# EAGLE design Complete-Power-Supply (EAGLE 9.0.0)
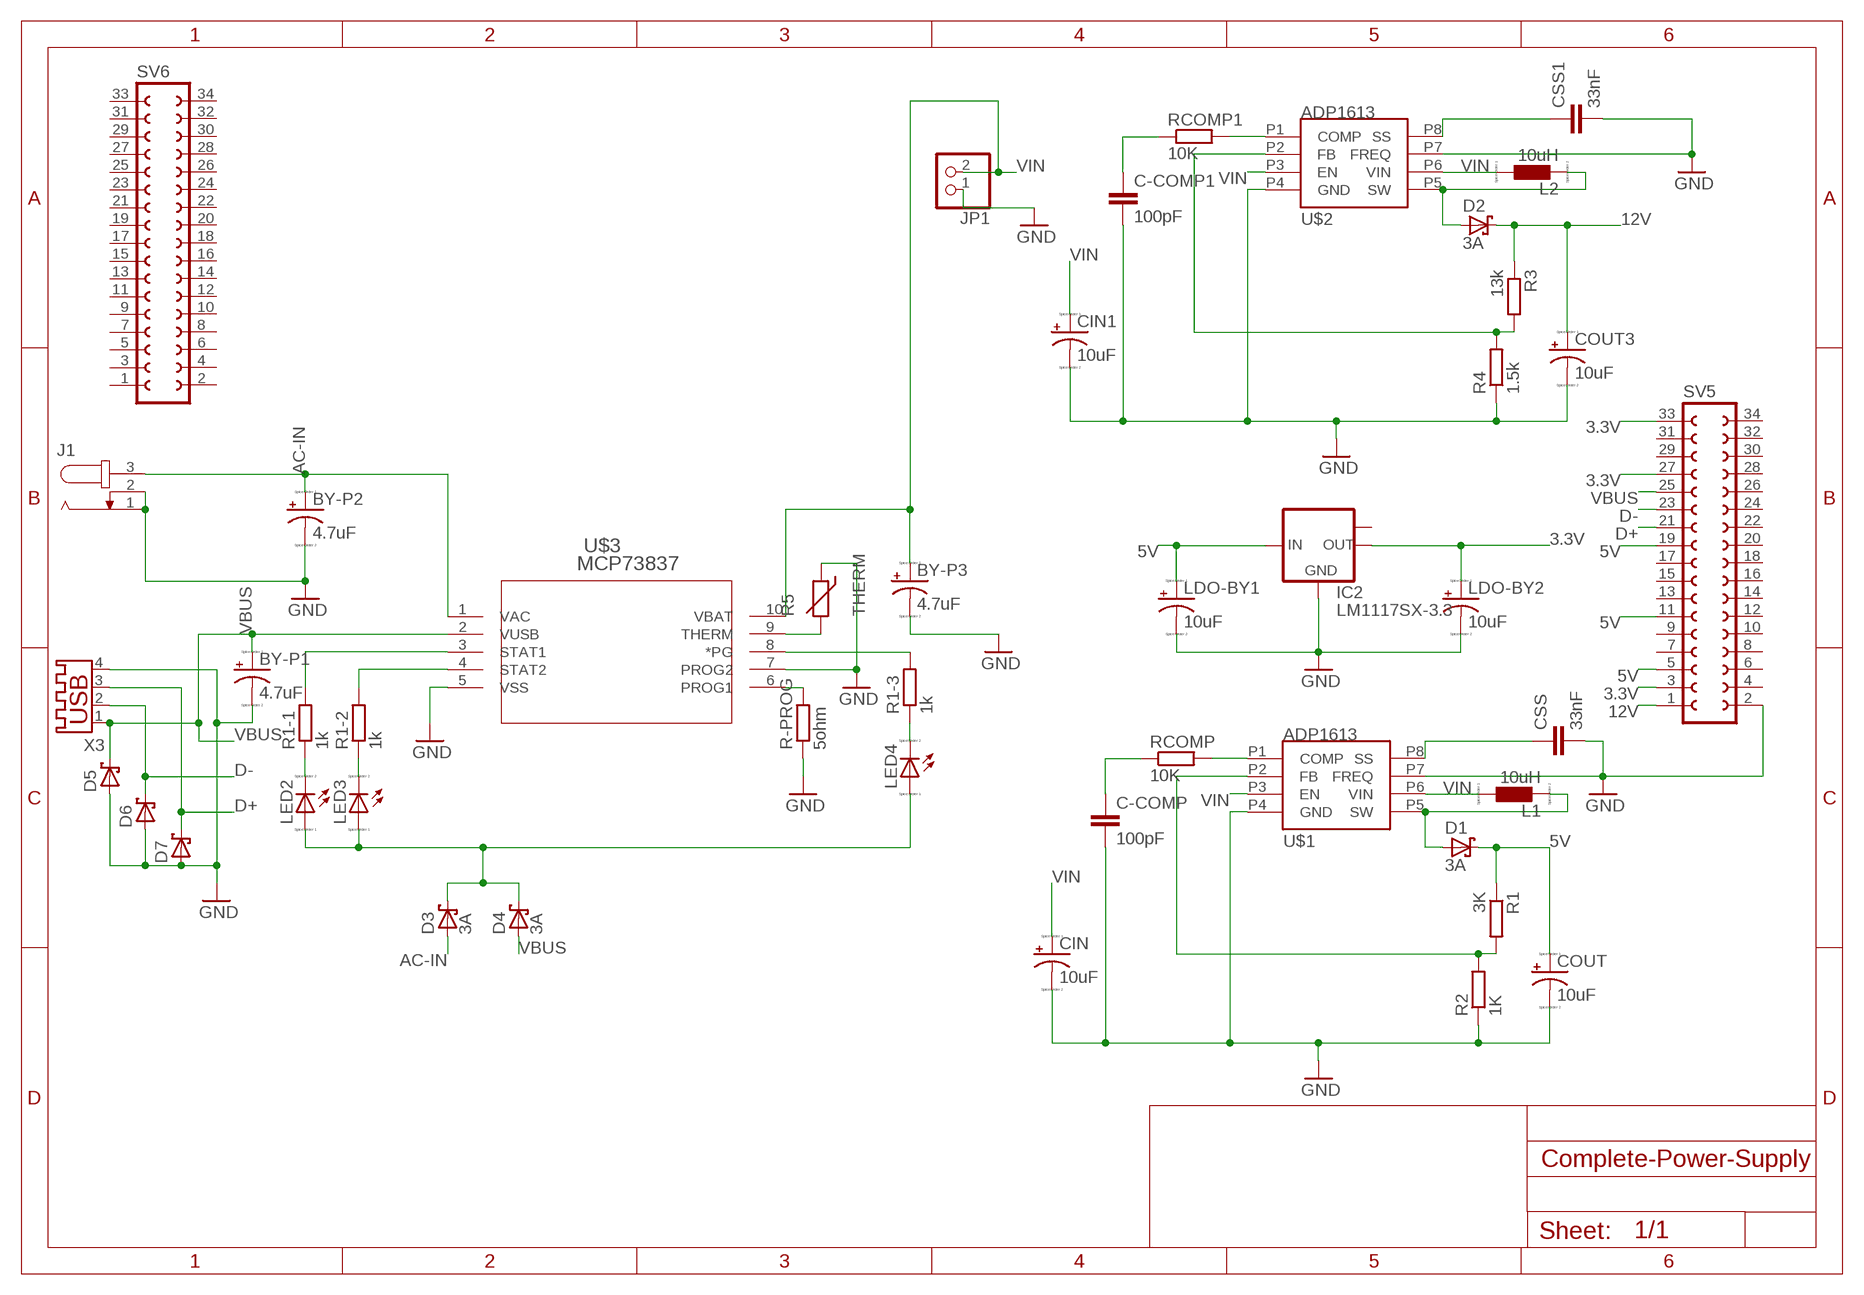
[diagram p0: schematic, sheet 1]

## Parts
BY-P1  4.7uF  CPOL-USCT3528  [CT3528]
BY-P2  4.7uF  CPOL-USCT3528  [CT3528]
BY-P3  4.7uF  CPOL-USCT3528  [CT3528]
C-COMP  100pF  C-EUC1206K  [C1206K]
C-COMP1  100pF  C-EUC1206K  [C1206K]
CIN  10uF  CPOL-USCT3528  [CT3528]
CIN1  10uF  CPOL-USCT3528  [CT3528]
COUT  10uF  CPOL-USCT3528  [CT3528]
COUT3  10uF  CPOL-USCT3528  [CT3528]
CSS  33nF  C-EUC1206K  [C1206K]
CSS1  33nF  C-EUC1206K  [C1206K]
D1  3A  SCHOTTKY-DIODESMD  [SMB]
D2  3A  SCHOTTKY-DIODESMD  [SMB]
D3  3A  SCHOTTKY-DIODESMD  [SMB]
D4  3A  SCHOTTKY-DIODESMD  [SMB]
D5  SCHOTTKY-DIODESMD  [SMB]
D6  SCHOTTKY-DIODESMD  [SMB]
D7  SCHOTTKY-DIODESMD  [SMB]
IC2  LM1117SX-3.3  [TO263]
J1  JACK-PLUG1  [SPC4078]
JP1  PINHD-1X2/90  [1X02/90]
L1  10uH  L0207/10  [0207/10]
L2  10uH  L0207/10  [0207/10]
LDO-BY1  10uF  CPOL-USCT3528  [CT3528]
LDO-BY2  10uF  CPOL-USCT3528  [CT3528]
LED2  LED_ESML0603  [LED_SML0603]
LED3  LED_ESML0603  [LED_SML0603]
LED4  LED_ESML0603  [LED_SML0603]
R1  3K  R-EU_M0805  [M0805]
R1-1  1k  R-EU_M0805  [M0805]
R1-2  1k  R-EU_M0805  [M0805]
R1-3  1k  R-EU_M0805  [M0805]
R2  1K  R-EU_M0805  [M0805]
R3  13k  R-EU_M0805  [M0805]
R4  1.5k  R-EU_M0805  [M0805]
R5  THERM  THERMISTOR-5  [R-5]
R-PROG  5ohm  R-EU_M0805  [M0805]
RCOMP  10K  R-EU_M0805  [M0805]
RCOMP1  10K  R-EU_M0805  [M0805]
SV5  FE17-2W  [FE17-2W]
SV6  FE17-2W  [FE17-2W]
U$1  ADP1613  [RM-8]
U$2  ADP1613  [RM-8]
U$3  MCP73837  MCP73837-FCI/UN  [SOP50P490X110-8N]
X3  USB-A003  [USB-A003]

## Nets
3.3V: IC2.2(OUT) LDO-BY2.-(+) SV5.3 SV5.27 SV5.33
5V: COUT.-(+) D1.C IC2.3(IN) LDO-BY1.-(+) R1.1 SV5.5 SV5.11 SV5.19
12V: COUT3.-(+) D2.C R3.1 SV5.1
AC-IN: BY-P2.-(+) D3.A J1.3 U$3.1(VAC)
D+: D7.C SV5.21 X3.3
D-: D6.C SV5.23 X3.2
GND: BY-P1.+(-) BY-P2.+(-) BY-P3.+(-) C-COMP1.2 C-COMP.2 CIN1.+(-) CIN.+(-) COUT3.+(-) COUT.+(-) CSS1.2 CSS.2 D5.A D6.A D7.A IC2.1(GND) J1.1 J1.2 JP1.1 LDO-BY1.+(-) LDO-BY2.+(-) R2.1 R4.1 R5.1 R-PROG.1 SV5.2 U$1.P4(GND) U$1.P7(FREQ) U$2.P4(GND) U$2.P7(FREQ) U$3.5(VSS) U$3.7(PROG2) X3.4
N$1: CSS.1 U$1.P8(SS)
N$2: D1.A L1.2 U$1.P5(SW)
N$3: RCOMP.2 U$1.P1(COMP)
N$4: C-COMP.1 RCOMP.1
N$5: D2.A L2.2 U$2.P5(SW)
N$6: R1.2 R2.2 U$1.P2(FB)
N$7: CSS1.1 U$2.P8(SS)
N$8: RCOMP1.2 U$2.P1(COMP)
N$9: R3.2 R4.2 U$2.P2(FB)
N$11: C-COMP1.1 RCOMP1.1
N$12: R-PROG.2 U$3.6(PROG1)
N$13: R5.2 U$3.9(THERM)
N$15: LED2.C R1-1.1
N$16: R1-1.2 U$3.3(STAT1)
N$17: R1-2.2 U$3.4(STAT2)
N$18: R1-3.2 U$3.8(*PG)
N$19: LED3.C R1-2.1
N$20: LED4.C R1-3.1
N$23: D3.C D4.C LED2.A LED3.A LED4.A
VBUS: BY-P1.-(+) D4.A D5.C SV5.25 U$3.2(VUSB) X3.1
VIN: BY-P3.-(+) CIN1.-(+) CIN.-(+) JP1.2 L1.1 L2.1 U$1.P3(EN) U$1.P6(VIN) U$2.P3(EN) U$2.P6(VIN) U$3.10(VBAT)
Unconnected: IC2.TAB(OUT1) SV5.4 SV5.6 SV5.7 SV5.8 SV5.9 SV5.10 SV5.12 SV5.13 SV5.14 SV5.15 SV5.16 SV5.17 SV5.18 SV5.20 SV5.22 SV5.24 SV5.26 SV5.28 SV5.29 SV5.30 SV5.31 SV5.32 SV5.34 SV6.1 SV6.2 SV6.3 SV6.4 SV6.5 SV6.6 SV6.7 SV6.8 SV6.9 SV6.10 SV6.11 SV6.12 SV6.13 SV6.14 SV6.15 SV6.16 SV6.17 SV6.18 SV6.19 SV6.20 SV6.21 SV6.22 SV6.23 SV6.24 SV6.25 SV6.26 SV6.27 SV6.28 SV6.29 SV6.30 SV6.31 SV6.32 SV6.33 SV6.34

## Library data of the parts
BY-P1-BY-P3 CIN CIN1 COUT COUT3 LDO-BY1 LDO-BY2 = resistor:CPOL-US: POLARIZED CAPACITOR, American symbol
C-COMP C-COMP1 CSS CSS1 = rcl:C-EU: CAPACITOR, European symbol; SPICEPREFIX: C
D1-D7 = diode:SCHOTTKY-DIODE: Schottky Diode
IC2 = lm1117:LM1117SX-*
J1 = con-jack:JACK-PLUG: DC POWER JACK Power Jack, DC, Right Angle, Through Hole, Rated 5A at 16VDC, PC Terminals Distributor: Farnell (www.Farnell.de) Drawing: 84N1161.pdf / 84N1162.pdf Manufacturer: SPC Technology (www.spctechnology.com) Type: SPC4077 / SPC 4078; OC_FARNELL: unknown; OC_NEWARK: unknown
JP1 = pinhead:PINHD-1X2: PIN HEADER
L1 L2 = eagle-ltspice:L: INDUCTOR, European symbol; SPICEMODEL: NONE; SPICEPREFIX: L
LED2-LED4 = eagle-ltspice:LED_E: LED Source: http://www.osram.convergy.de Source: www.luxeon.com Source: www.kingbright.com; SPICEMODEL: NONE; SPICEPREFIX: D; SPICETYPE: diode
R1 R1-1-R1-3 R2-R4 R-PROG RCOMP RCOMP1 = resistor:R-EU_: RESISTOR, European symbol
R5 = varistor:THERMISTOR: THERMISTOR
SV5 SV6 = con-lsta:FE17-2W: FEMALE HEADER; OC_FARNELL: unknown; OC_NEWARK: unknown
U$1 U$2 = adp1613:ADP1613
U$3 = MCP73837-FCI_UN:MCP73837-FCI/UN: Battery Charger; AVAILABILITY: Unavailable; DESCRIPTION: MCP73837 Series 6 V Linear Battery Charge Controller Surface Mount - MSOP-10; MF: Microchip; MP: MCP73837-FCI/UN; PACKAGE: MSOP-10 Microchip; PRICE: None
X3 = con-yamaichi:USB-A003: USB connector; OC_FARNELL: unknown; OC_NEWARK: unknown

## Module NEW
Ports: 

### Library data of the parts

## Board
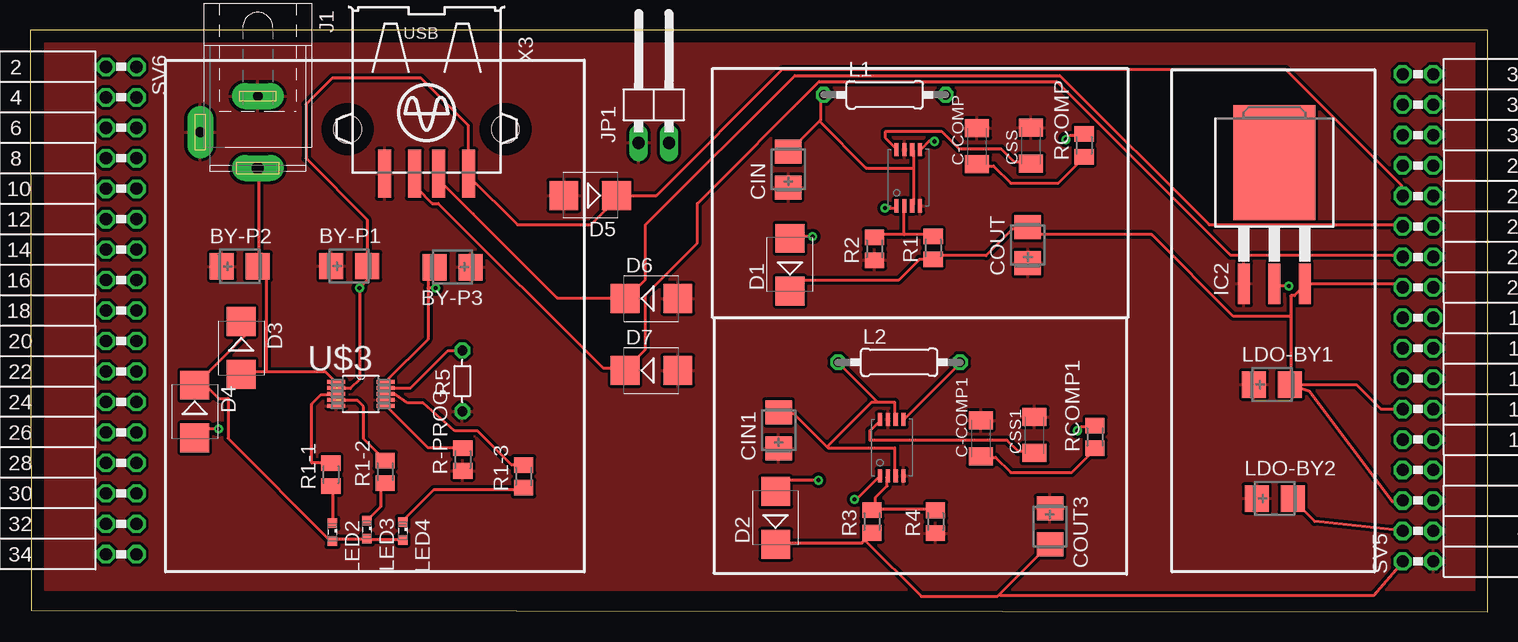
[diagram p1: board, top side]
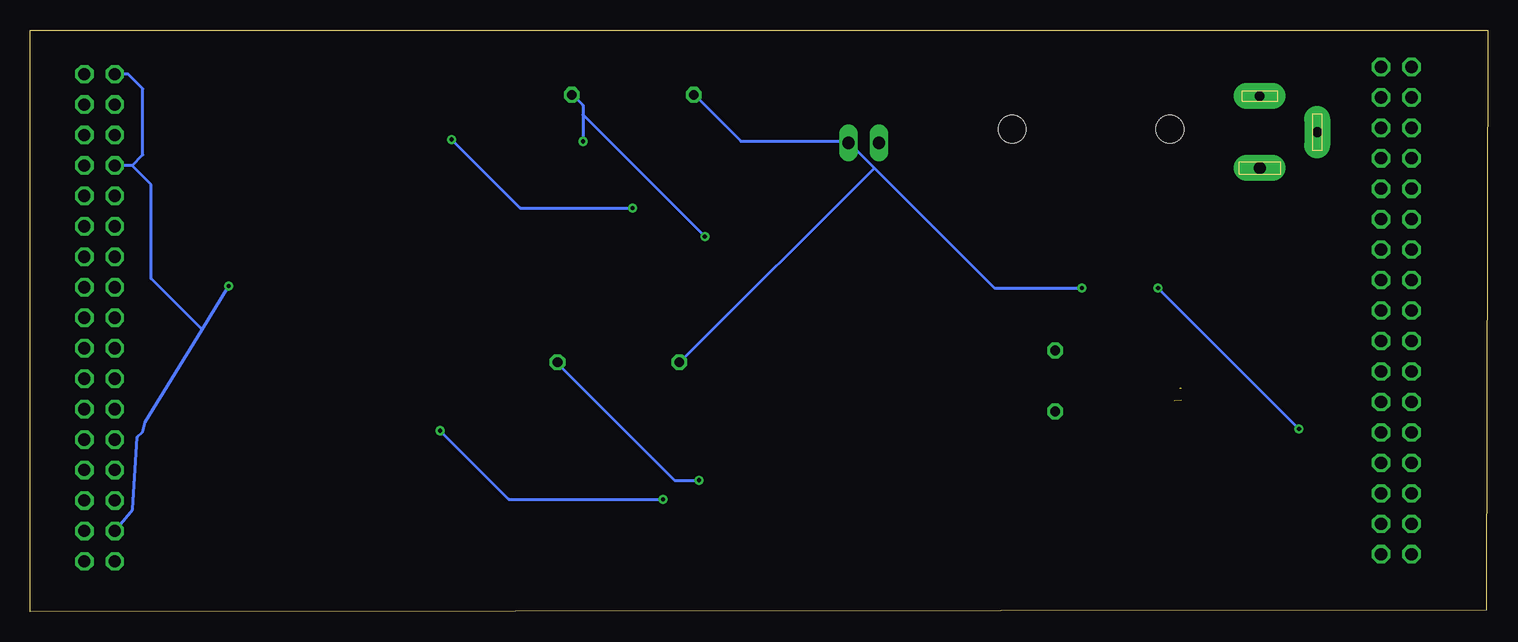
[diagram p2: board, bottom side, seen from below]

Size 121.5 x 48.5 mm. Coordinates in mm from the lower left corner, seen from the top.
Outline: 0.1,0.1 121.5,0 121.5,48.5 0,48.5 0.1,0.1
Copper layers (1*16): Top 0.035mm / dielectric 1.5mm / Bottom 0.035mm
Design rules "default *": minimum track width 10mil, minimum drill 0.35mm, track to track 10mil, track to pad 6mil, pad to pad 6mil, via to via 10mil, smd to smd 6mil, copper to edge 40mil, drill to drill 6mil, minimum pad ring 10mil, minimum via ring 8mil, stop-mask expansion 4mil, vias tented up to drill 0mil, thermal gap 10mil

### Footprints (pad centres in the part's own frame; a part is rotated, then mirrored left to right if it is on the bottom)
CT3528 = smd 2 x 2.2: + -1.5,0; - 1.5,0
C1206K = smd 1.5 x 2: 1 -1.5,0; 2 1.5,0
SMB = smd 2.4 x 2.4: A 2.2,0; C -2.2,0
TO263 = smd 1 x 3.4: 1 -2.54,-6.6; 2 0,-6.6; 3 2.54,-6.6 | smd 6.8 x 9.6: TAB 0,3.5
SPC4078 = drill 0.8 pad 2.184 long: 1 -3,0; 2 0,-4.8 | drill 1 pad 2.184 long: 3 3,0
1X02/90 = drill 1.016 long: 1 -1.27,-3.81; 2 1.27,-3.81
0207/10 = drill 0.813 octagon: 1 -5.08,0; 2 5.08,0
LED_SML0603 = smd 0.8 x 0.8: A 0.75,0; C -0.75,0
M0805 = smd 1.3 x 1.6: 1 -0.95,0; 2 0.95,0
R-5 = drill 0.813 octagon: 1 -2.54,0; 2 2.54,0
FE17-2W = drill 1.016 octagon: 1 -20.32,1.27; 2 -20.32,-1.27; 3 -17.78,1.27; 4 -17.78,-1.27; 5 -15.24,1.27; 6 -15.24,-1.27; 7 -12.7,1.27; 8 -12.7,-1.27; 9 -10.16,1.27; 10 -10.16,-1.27; 11 -7.62,1.27; 12 -7.62,-1.27; 13 -5.08,1.27; 14 -5.08,-1.27; 15 -2.54,1.27; 16 -2.54,-1.27; 17 0,1.27; 18 0,-1.27; 19 2.54,1.27; 20 2.54,-1.27; 21 5.08,1.27; 22 5.08,-1.27; 23 7.62,1.27; 24 7.62,-1.27; 25 10.16,1.27; 26 10.16,-1.27; 27 12.7,1.27; 28 12.7,-1.27; 29 15.24,1.27; 30 15.24,-1.27; 31 17.78,1.27; 32 17.78,-1.27; 33 20.32,1.27; 34 20.32,-1.27
RM-8 = smd 1.1 x 0.35: P1 -4.7,0.7; P2 -4.7,0.05; P3 -4.7,-0.6; P4 -4.7,-1.25; P5 0,-1.25; P6 0,-0.6; P7 0,0.05; P8 0,0.7
SOP50P490X110-8N = smd 1.499 x 0.33: 1 -2.057,0.991; 2 -2.057,0.508; 3 -2.057,0; 4 -2.057,-0.508; 5 -2.057,-0.991; 6 2.057,-0.991; 7 2.057,-0.508; 8 2.057,0; 9 2.057,0.508; 10 2.057,0.991
USB-A003 = smd 1.12 x 4: 1 -3.5,14; 2 -1,14; 3 1,14; 4 3.5,14 | hole 2.3: -6.57,10.28; 6.57,10.28

### Placement (x,y rotation side)
BY-P1  26.61,28.81 0 top
BY-P2  17.49,28.79 0 top
BY-P3  35.23,28.72 180 top
C-COMP  78.94,38.8 90 top
C-COMP1  79.26,14.44 90 top
CIN  63.21,36.87 90 top
CIN1  62.41,15.12 90 top
COUT  83.17,30.56 90 top
COUT3  85.03,7.09 270 top
CSS  83.44,38.84 90 top
CSS1  83.74,14.72 90 top
D1  63.36,28.93 90 top
D2  62.16,7.81 90 top
D3  17.61,21.98 270 top
D4  13.73,16.68 270 top
D5  46.7,34.7 180 top
D6  51.8,26.1 0 top
D7  51.8,20.1 0 top
IC2  103.73,33.94 0 top
J1  18.99,39.98 270 top
JP1  52,42.9 0 top
L1  71.25,43.09 0 top
L2  72.45,20.79 0 top
LDO-BY1  103.53,18.93 0 top
LDO-BY2  103.75,9.43 0 top
LED2  25.21,6.62 270 top
LED3  28.09,6.82 270 top
LED4  31.07,6.72 270 top
R1  75.29,30.33 90 top
R1-1  25.09,11.42 90 top
R1-2  29.6,11.65 90 top
R1-3  41.15,11.27 90 top
R2  70.39,30.25 90 top
R3  70.19,7.51 90 top
R4  75.49,7.49 90 top
R5  36.04,19.23 90 top
R-PROG  36.08,12.68 90 top
RCOMP  87.88,38.88 90 top
RCOMP1  88.78,14.56 90 top
SV5  115.7,24.5 90 top
SV6  7.6,25.1 270 top
U$1  72.94,38.53 90 top
U$2  71.56,16.01 90 top
U$3  27.58,18.14 0 top
X3  33.06,50.51 180 top

### Tracks (layer width: path | path; a pad name or v marks a point on that pad's centre or on a via)
3.3V  (via drill 0.35)
  Top 0.254: LDO-BY2.- 105.25,9.37 107.1,7.52 SV5.3 114.49,6.72 | v104.93,27.15 103.98,27.15 103.82,27.3 IC2.2
  Bottom 0.254: 107.16,23.51 111.89,15.79 112.12,14.99 112.56,14.56 112.96,8.53 114.35,6.82 SV5.3 | 107.16,23.51 v104.93,27.15 | 107.16,23.51 111.4,27.75 111.4,35.6 113,37.2 | 113,37.2 SV5.27 | 113,37.2 112.1,38.1 112.1,43.6 113.32,44.82 SV5.33
5V
  Top 0.254: D1.C 63.5,26.83 64.29,27.62 72.39,27.62 74.14,29.37 75.25,29.37 R1.1 75.41,29.53 75.56,29.69 79.69,29.69 81.92,31.91 83.03,31.91 COUT.- 83.19,31.91 83.66,31.43 93.5,31.43 100.33,24.61 105.09,24.61 | 105.09,24.61 105.09,26.35 105.41,26.35 106.36,27.3 IC2.3 114.13,27.34 SV5.19 | 105.09,24.61 105.09,19.05 LDO-BY1.- | SV5.5 113.59,9.16 106.66,18.39 105.09,18.89 LDO-BY1.- | LDO-BY1.- 110.57,18.93 112.62,16.88 SV5.11
12V
  Top 0.254: 69.61,5.95 69.37,5.71 62.23,5.71 D2.C | 69.61,5.95 70.17,6.51 R3.1 | 80.72,1.35 80.64,1.27 74.3,1.27 69.61,5.95 | 80.72,1.35 84.93,5.56 COUT3.- | SV5.1 114.39,4.12 112.04,1.37 80.9,1.37 80.72,1.35
AC-IN
  Top 0.254: 19.68,20 17.78,20 17.62,19.84 D3.A | 19.68,20 24.61,20 25.4,19.21 U$3.1 | J1.3 19.05,36.83 19.05,28.89 BY-P2.- 19.05,28.73 19.68,28.73 19.68,20
D+
  Top 0.254: X3.3 32.26,36.32 32.26,35.31 33.53,34.04 34.04,34.04 47.75,20.32 49.53,20.32 D7.C 49.78,20.32 51.31,21.84 51.31,26.42 55.63,30.73 55.63,34.04 65.79,44.2 85.6,44.2 100.08,29.72 114.3,29.72 SV5.21
D-
  Top 0.254: X3.2 34.29,36.32 34.29,35.81 36.95,33.15 43.94,26.16 49.53,26.16 D6.C 49.78,26.16 51.31,27.69 51.31,32.26 63.75,44.7 85.85,44.7 98.3,32.26 114.3,32.26 SV5.23
GND
  pour Top: 2.6,47.5 120.8,47.5 120.8,1.8 120.6,1.8 1.3,1.8 1.3,47.5
N$1
  Top 0.254: U$1.P8 72.23,38.58 71.28,39.53 71.28,40.01 76.04,40.01 77.47,38.58 80.96,38.58 82.07,37.47 83.34,37.47 CSS.1
N$2  (via drill 0.35)
  Top 0.254: v75.41,39.21 74.93,39.21 74.3,38.58 U$1.P5 | v65.25,31.27 63.5,31.27 D1.A
  Bottom 0.254: 75.41,41.43 75.41,42.23 76.2,43.02 L1.2 | 75.41,41.43 v75.41,39.21 | 75.41,41.43 v65.25,31.27
N$3  (via drill 0.35)
  Top 0.254: v71.28,33.66 72.07,33.66 72.23,33.81 U$1.P1 | v86.36,39.37 86.68,39.69 87.79,39.69 RCOMP.2
  Bottom 0.254: v71.28,33.66 80.64,33.66 v86.36,39.37
N$4
  Top 0.254: RCOMP.1 87.79,37.78 85.72,35.72 81.76,35.72 80.33,37.15 79.06,37.15 C-COMP.1
N$5  (via drill 0.35)
  Top 0.254: U$2.P5 72.87,16.03 77.47,20.64 L2.2 | v65.72,10.95 63.02,10.95 62.23,10.16 D2.A
  Bottom 0.254: v65.72,10.95 67.79,10.95 77.47,20.64 L2.2
N$6
  Top 0.254: 72.87,31.43 72.87,33.81 U$1.P2 | 72.87,31.43 75.25,31.43 R1.2 | 72.87,31.43 70.64,31.43 70.48,31.27 R2.2
N$7
  Top 0.254: U$2.P8 70.8,15.88 70.01,15.08 70.01,14.29 81.44,14.29 82.39,13.34 83.66,13.34 CSS1.1
N$8  (via drill 0.35)
  Top 0.254: v68.74,9.37 68.9,9.37 70.8,11.27 U$2.P1 | v87.31,15.08 87.63,15.4 88.74,15.4 RCOMP1.2
  Bottom 0.254: v68.74,9.37 81.6,9.37 v87.31,15.08
N$9
  Top 0.254: 70.48,8.57 70.48,9.53 71.44,10.48 71.44,11.27 U$2.P2 | 70.48,8.57 70.33,8.57 R3.2 70.48,8.57 | 70.48,8.57 75.41,8.57 R4.2
N$11
  Top 0.254: RCOMP1.1 88.74,13.49 86.84,11.59 81.76,11.59 80.49,12.86 79.38,12.86 C-COMP1.1
N$12
  Top 0.254: U$3.6 29.69,17.14 33.18,13.65 36.04,13.65 R-PROG.2
N$13
  Top 0.254: U$3.9 31.75,18.65 34.87,21.77 R5.2
N$15
  Top 0.254: LED2.C 25.24,7.46 25.24,10.32 R1-1.1
N$16
  Top 0.254: U$3.3 25.4,18.1 24.29,18.1 23.5,17.3 23.5,12.38 25.08,12.38 R1-1.2
N$17  (1 unrouted)
  Top 0.254: R1-2.2 27.8,14.4 27.8,17.1 27.31,17.59 26.1,17.59
N$18
  Top 0.254: U$3.8 29.69,18.1 30.48,18.1 31.5,17.41 32.77,17.41 35.4,15.08 37.31,15.08 40.16,12.22 41.12,12.22 R1-3.2
N$19
  Top 0.254: LED3.C 28.1,7.62 29.21,8.73 29.21,10.64 29.53,10.64 R1-2.1
N$20
  Top 0.254: LED4.C 31.11,7.62 33.66,10.16 40.96,10.16 41.12,10.32 R1-3.1
N$23
  Top 0.254: LED4.A 30.96,6.03 28.1,6.03 LED3.A 27.94,6.03 25.4,6.03 25.24,5.87 LED2.A 25.08,5.87 16.51,14.45 16.51,17.78 15.72,17.78 14.29,19.21 D4.C 13.81,18.89 18.1,23.18 18.1,24.13 17.62,24.13 D3.C
VBUS  (via drill 0.35)  (1 unrouted)
  Top 0.254: SV5.25 114.3,34.8 114.3,35.56 104.65,45.21 62.74,45.21 52.23,34.7 D5.C 49.05,34.55 | v15.72,15.24 14.45,15.24 13.81,14.61 D4.A | 25.66,18.64 25.74,18.6 26.7,18.6 27.46,19.36 v27.46,26.99 28.11,27.63 BY-P1.- 28.1,32.7 23,37.8 23,42.3 25.2,44.5 32.6,44.5 36.56,40.54 X3.1 36.58,36.32 40.64,32.26 46.76,32.26 49.05,34.55 | 49.53,34.07 49.05,34.55
  Bottom 0.254: v27.46,26.99 v15.72,15.24
VIN  (via drill 0.35)
  Top 0.254: 66.44,13.73 63.66,16.51 62.55,16.51 CIN1.- | 66.44,13.73 66.52,13.65 72.07,13.65 72.07,11.43 U$2.P3 | 70.64,17.46 70.17,17.46 66.44,13.73 | 70.64,17.46 72.07,17.46 72.07,16.03 U$2.P6 | 70.64,17.46 67.47,20.64 L2.1 | 33.18,26.99 33.18,28.57 33.66,28.57 BY-P3.- | 33.18,26.99 33.18,22.7 29.69,19.21 U$3.10 | 73.66,36.99 73.66,38.42 U$1.P6 | 73.66,36.99 73.66,33.97 U$1.P3 | 65.8,40.88 65.88,40.96 65.88,43.02 66.04,43.02 L1.1 | 65.8,40.88 63.34,38.42 CIN.- | 73.66,36.99 69.69,36.99 65.8,40.88 | v33.81,26.99 33.18,26.99
  Bottom 0.254: L1.1 66.04,43.02 62.23,39.21 53.34,39.21 JP1.2 53.18,39.05 51.12,36.99 | v33.81,26.99 41.12,26.99 51.12,36.99 | 51.12,36.99 67.31,20.8 L2.1